# Altium schematic sheet schGarra.SchDoc
size A4
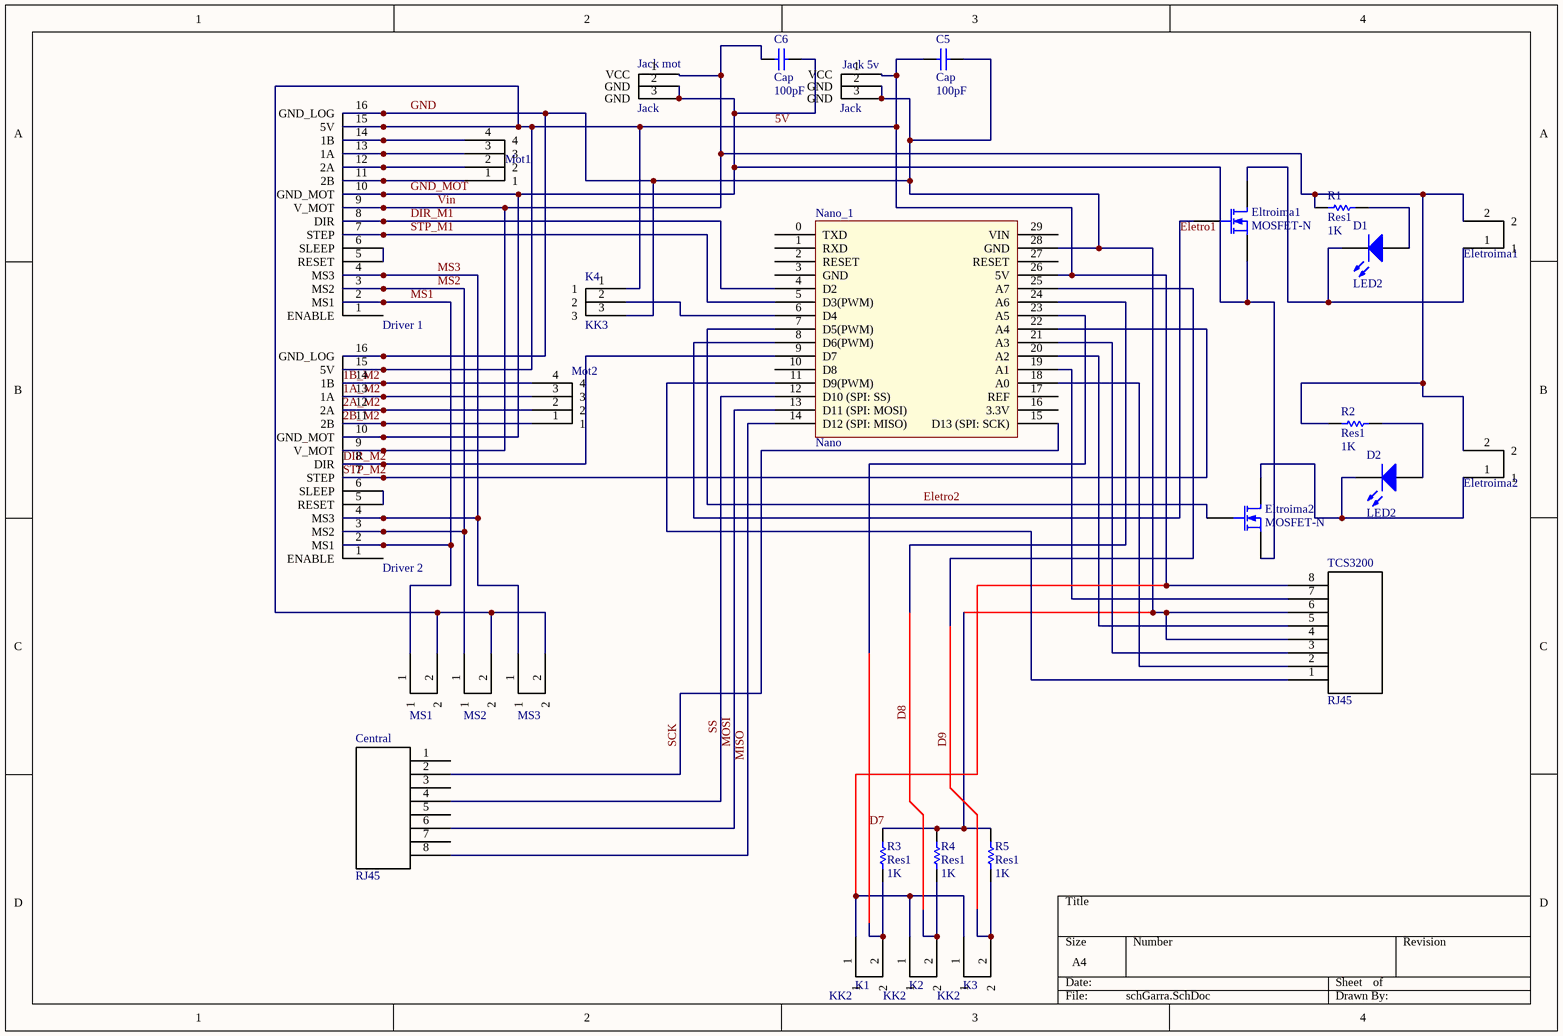
[diagram p0: schGarra.SchDoc]

## Parts
C5  Cap  value 100pF  [RAD-0.3]
C6  Cap  value 100pF  [RAD-0.3]
Central  RJ45  [RJ45_Simples]
D1  LED2  [2-vias]
D2  LED2  [2-vias]
Driver_1  A4988  [A4988]  (value not drawn)
Driver_2  A4988  [A4988]  (value not drawn)
Eletroima1  KK2  [2-vias]  (value not drawn)
Eletroima2  KK2  [2-vias]  (value not drawn)
Eltroima1  MOSFET-N  [3-vias]
Eltroima2  MOSFET-N  [3-vias]
Jack_5v  Jack  [JACK J4]
Jack_mot  Jack  [JACK J4]
K1  KK2  [2-vias]
K2  KK2  [2-vias]
K3  KK2  [2-vias]
K4  KK3  [3-vias]
Mot1  KK4  [4-vias]  (value not drawn)
Mot2  KK4  [4-vias]  (value not drawn)
MS1  KK2  [2-vias]  (value not drawn)
MS2  KK2  [2-vias]  (value not drawn)
MS3  KK2  [2-vias]  (value not drawn)
Nano_1  Nano  [Arduino_Nano]
R1  Res1  value 1K  [AXIAL-0.3]
R2  Res1  value 1K  [AXIAL-0.3]
R3  Res1  value 1K  [AXIAL-0.3]
R4  Res1  value 1K  [AXIAL-0.3]
R5  Res1  value 1K  [AXIAL-0.3]
TCS3200  RJ45  [RJ45_Simples]

## Nets
1A_M2: Driver_2.13(1A) Mot2.3
1B_M2: Driver_2.14(1B) Mot2.4
2A_M2: Driver_2.12(2A) Mot2.2
2B_M2: Driver_2.11(2B) Mot2.1
5V: C5.1 Driver_1.15(5V) Driver_2.15(5V) Jack_5v.1(VCC) K1.1 K2.1 K3.1 K4.1 MS1.2 MS2.2 MS3.2 Nano_1.26(5V) TCS3200.8
D7: K1.2 Nano_1.23(A5) R3.1
D8: K2.2 Nano_1.24(A6) R4.1
D9: K3.2 Nano_1.25(A7) R5.1
DIR_M1: Driver_1.8(DIR) Nano_1.4(D2)
DIR_M2: Driver_2.8(DIR) Nano_1.9(D7)
Eletro1: Eltroima1.1(G) Nano_1.8(D6(PWM))
Eletro2: Eltroima2.1(G) Nano_1.7(D5(PWM))
GND: C5.2 Driver_1.16(GND_LOG) Driver_2.16(GND_LOG) Jack_5v.2(GND) Jack_5v.3(GND) K4.3 Nano_1.28(GND) R3.2 R4.2 R5.2 TCS3200.4 TCS3200.6
GND_MOT: C6.2 Driver_1.10(GND_MOT) Driver_2.10(GND_MOT) Eltroima1.3(S) Eltroima2.3(S) Jack_mot.2(GND) Jack_mot.3(GND)
MISO: Central.8 Nano_1.14(D12_(SPI:_MISO))
MOSI: Central.6 Nano_1.13(D11_(SPI:_MOSI))
MS1: Driver_1.2(MS1) Driver_2.2(MS1) MS1.1
MS2: Driver_1.3(MS2) Driver_2.3(MS2) MS2.1
MS3: Driver_1.4(MS3) Driver_2.4(MS3) MS3.1
SCK: Central.2 Nano_1.15(D13_(SPI:_SCK))
SS: Central.4 Nano_1.12(D10_(SPI:_SS))
STP_M1: Driver_1.7(STEP) Nano_1.5(D3(PWM))
STP_M2: Driver_2.7(STEP) Nano_1.22(A4)
Vin: C6.1 Driver_1.9(V_MOT) Driver_2.9(V_MOT) Eletroima1.2 Eletroima2.2 Jack_mot.1(VCC) R1.2 R2.1
NetD1_1: D1.1(A) R1.1
NetD1_2: D1.2(K) Eletroima1.1 Eltroima1.2(D)
NetD2_1: D2.1(A) R2.2
NetD2_2: D2.2(K) Eletroima2.1 Eltroima2.2(D)
NetDriver_1_5: Driver_1.5(RESET) Driver_1.6(SLEEP)
NetDriver_1_11: Driver_1.11(2B) Mot1.1
NetDriver_1_12: Driver_1.12(2A) Mot1.2
NetDriver_1_13: Driver_1.13(1A) Mot1.3
NetDriver_1_14: Driver_1.14(1B) Mot1.4
NetDriver_2_5: Driver_2.5(RESET) Driver_2.6(SLEEP)
NetK4_2: K4.2 Nano_1.6(D4)
NetNano_1_11: Nano_1.11(D9(PWM)) TCS3200.1
NetNano_1_18: Nano_1.18(A0) TCS3200.2
NetNano_1_19: Nano_1.19(A1) TCS3200.7
NetNano_1_20: Nano_1.20(A2) TCS3200.5
NetNano_1_21: Nano_1.21(A3) TCS3200.3

Not connected (* = marked no-connect by the designer): Central 1(9) 3 5 7; Driver_1 1(ENABLE); Driver_2 1(ENABLE); Nano_1 0(TXD) 1(RXD) 2(RESET) 3(GND) 10(D8) 16(3.3V) 17(REF) 27(RESET) 29(VIN)

## Library data of the parts
C5 C6 = Cap: Capacitor; Published: 8-Jun-2000; LatestRevisionDate: 17-Jul-2002; LatestRevisionNote: Re-released for DXP Platform.; PackageReference: RAD-0.3; Publisher: Altium Limited; PackageDescription: Radial Cap, Thru-Hole; 2 Leads; 0.3 in Pin Spacing
D1 D2 = LED2: Typical RED, GREEN, YELLOW, AMBER GaAs LED; Published: 8-Jun-2000; LatestRevisionDate: 17-Jul-2002; LatestRevisionNote: Re-released for DXP Platform.; PackageVersion: Feb-2002; PackageReference: 3.2X1.6X1.1; Publisher: Altium Limited; PackageDescription: SM LED; 2 Flat Leads
Eletroima1 Eletroima2 K1-K3 MS1-MS3 = KK2Vias
Eltroima1 Eltroima2 = MOSFET-N: N-Channel MOSFET; Published: 8-Jun-2000; LatestRevisionDate: 17-Jul-2002; LatestRevisionNote: Re-released for DXP Platform.; PackageVersion: 1995/1996; PackageReference: E3; Publisher: Altium Limited; PackageDescription: TO, Flat Index; 3 In-Line, Axial Leads; Body Dia. 4.6mm; Lead Dia. 0.5 mm (max)
K4 = KK3Vias
Mot1 Mot2 = KK4Vias: ComponentLink1Description: Fabricante; ComponentLink1URL: https://www.molex.com/molex/products/family?key=kk_254_rpc_connector_system&channel=products&chanName=family&pageTitle=Introduction&parentKey=kk_interconnect_solutions
Nano_1 = Arduino_Nano
R1-R5 = Res1: Resistor; Published: 8-Jun-2000; LatestRevisionDate: 17-Jul-2002; LatestRevisionNote: Re-released for DXP Platform.; PackageReference: AXIAL-0.3; Publisher: Altium Limited; PackageDescription: Axial Device, Thru-Hole; 2 Leads; 0.3 in Pin Spacing